# EAGLE schematic gauge-adapter (EAGLE 7.7.0)
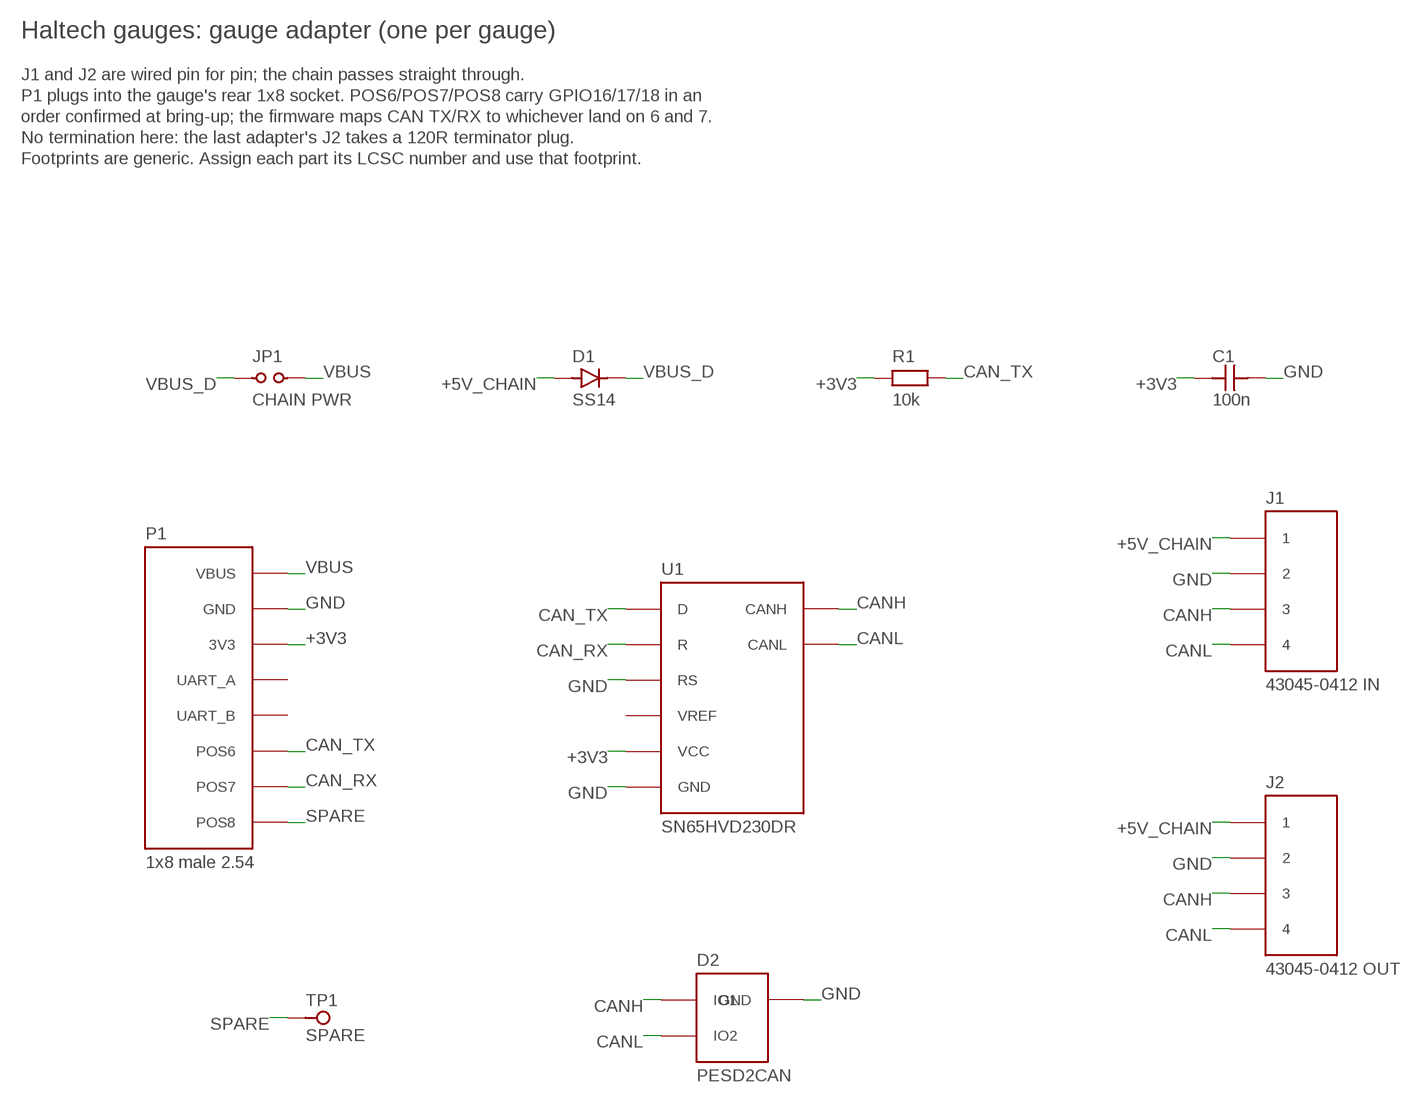
[diagram p0: schematic, sheet 1]

## Parts
C1  100n  C0805  [0805]
D1  SS14  SCHOTTKY-SMA  [SMA]
D2  PESD2CAN  [SOT23]
J1  43045-0412 IN  MICROFIT-2X2  [MOLEX-43045-0412]
J2  43045-0412 OUT  MICROFIT-2X2  [MOLEX-43045-0412]
JP1  CHAIN PWR  JUMPER-2  [HDR-1X2]
P1  1x8 male 2.54  GAUGE-HEADER  [HDR-1X8]
R1  10k  R0805  [0805]
TP1  SPARE  TESTPOINT  [TESTPAD]
U1  SN65HVD230DR  SN65HVD230  [SOIC8]

## Nets
+3V3: C1.1 P1.3(3V3) R1.1 U1.3(VCC)
+5V_CHAIN: D1.2(A) J1.1 J2.1
CAN_RX: P1.7(POS7) U1.4(R)
CAN_TX: P1.6(POS6) R1.2 U1.1(D)
CANH: D2.1(IO1) J1.3 J2.3 U1.7(CANH)
CANL: D2.2(IO2) J1.4 J2.4 U1.6(CANL)
GND: C1.2 D2.3(GND) J1.2 J2.2 P1.2(GND) U1.2(GND) U1.8(RS)
SPARE: P1.8(POS8) TP1.1(TP)
VBUS: JP1.2 P1.1(VBUS)
VBUS_D: D1.1(K) JP1.1
Unconnected: P1.4(UART_A) P1.5(UART_B) U1.5(VREF)

## Notes on the sheet
- Haltech gauges: gauge adapter (one per gauge)
- J1 and J2 are wired pin for pin; the chain passes straight through.
- P1 plugs into the gauge's rear 1x8 socket. POS6/POS7/POS8 carry GPIO16/17/18 in an
- order confirmed at bring-up; the firmware maps CAN TX/RX to whichever land on 6 and 7.
- No termination here: the last adapter's J2 takes a 120R terminator plug.
- Footprints are generic. Assign each part its LCSC number and use that footprint.

## Library data of the parts
C1 = haltech-gauges:C0805; LCSC: C49678
D1 = haltech-gauges:SCHOTTKY-SMA; LCSC: C2480
D2 = haltech-gauges:PESD2CAN; LCSC: C75176
J1 J2 = haltech-gauges:MICROFIT-2X2
JP1 = haltech-gauges:JUMPER-2
P1 = haltech-gauges:GAUGE-HEADER
R1 = haltech-gauges:R0805; LCSC: C17414
TP1 = haltech-gauges:TESTPOINT
U1 = haltech-gauges:SN65HVD230; LCSC: C12084